# EAGLE design 64K SRAM Memory Controller (EAGLE 7.5.0)
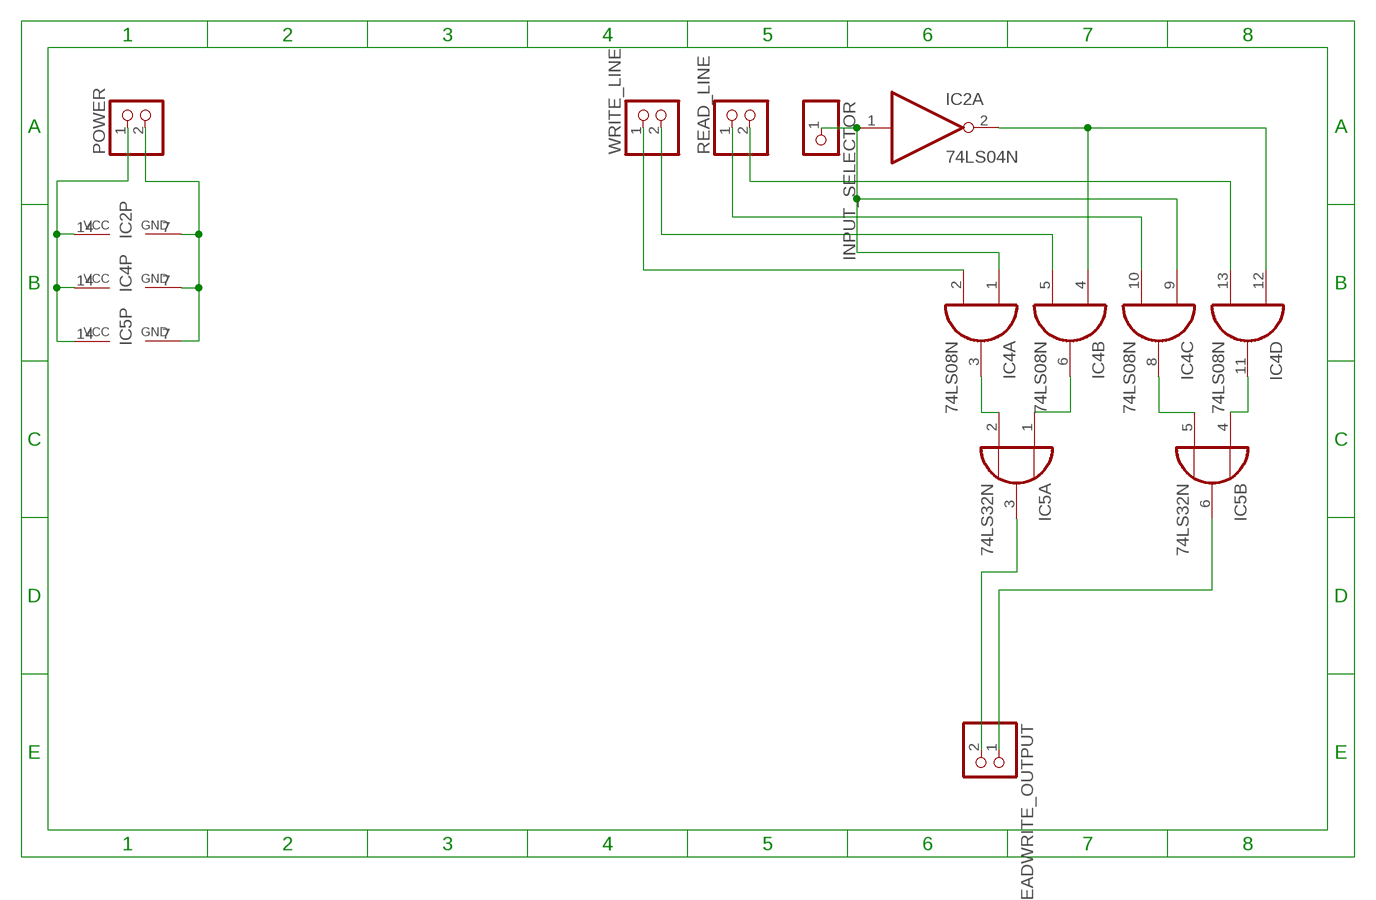
[diagram p0: schematic, sheet 1]

## Parts
IC2  74LS04N  [DIL14]
IC4  74LS08N  [DIL14]
IC5  74LS32N  [DIL14]
INPUT_SELECTOR  PINHD-1X1  [1X01]
POWER  PINHD-1X2  [1X02]
READ_LINE  PINHD-1X2  [1X02]
READWRITE_OUTPUT  PINHD-1X2  [1X02]
WRITE_LINE  PINHD-1X2  [1X02]

## Nets
GND: IC2.7(P:GND) IC4.7(P:GND) IC5.7(P:GND) POWER.2
N$18: IC2.1(A:I) IC4.1(A:I0) IC4.9(C:I0) INPUT_SELECTOR.1
N$19: IC5.6(B:O) READWRITE_OUTPUT.1
N$20: IC4.2(A:I1) WRITE_LINE.1
N$23: IC4.5(B:I1) WRITE_LINE.2
N$24: IC2.2(A:O) IC4.4(B:I0) IC4.12(D:I0)
N$25: IC5.3(A:O) READWRITE_OUTPUT.2
N$28: IC4.10(C:I1) READ_LINE.1
N$29: IC4.13(D:I1) READ_LINE.2
N$30: IC4.3(A:O) IC5.2(A:I1)
N$31: IC4.6(B:O) IC5.1(A:I0)
N$32: IC4.8(C:O) IC5.5(B:I1)
N$33: IC4.11(D:O) IC5.4(B:I0)
VCC: IC2.14(P:VCC) IC4.14(P:VCC) IC5.14(P:VCC) POWER.1
Unconnected: IC2.3(B:I) IC2.4(B:O) IC2.5(C:I) IC2.6(C:O) IC2.8(D:O) IC2.9(D:I) IC2.10(E:O) IC2.11(E:I) IC2.12(F:O) IC2.13(F:I) IC5.8(C:O) IC5.9(C:I0) IC5.10(C:I1) IC5.11(D:O) IC5.12(D:I0) IC5.13(D:I1)

## Library data of the parts
IC2 = 74xx-eu:74*04: Hex INVERTER
IC4 = 74xx-eu:74*08: Quad 2-input AND gate
IC5 = 74xx-eu:74*32: Quad 2-input OR gate
INPUT_SELECTOR = pinhead:PINHD-1X1: PIN HEADER
POWER READ_LINE READWRITE_OUTPUT WRITE_LINE = pinhead:PINHD-1X2: PIN HEADER

## Board
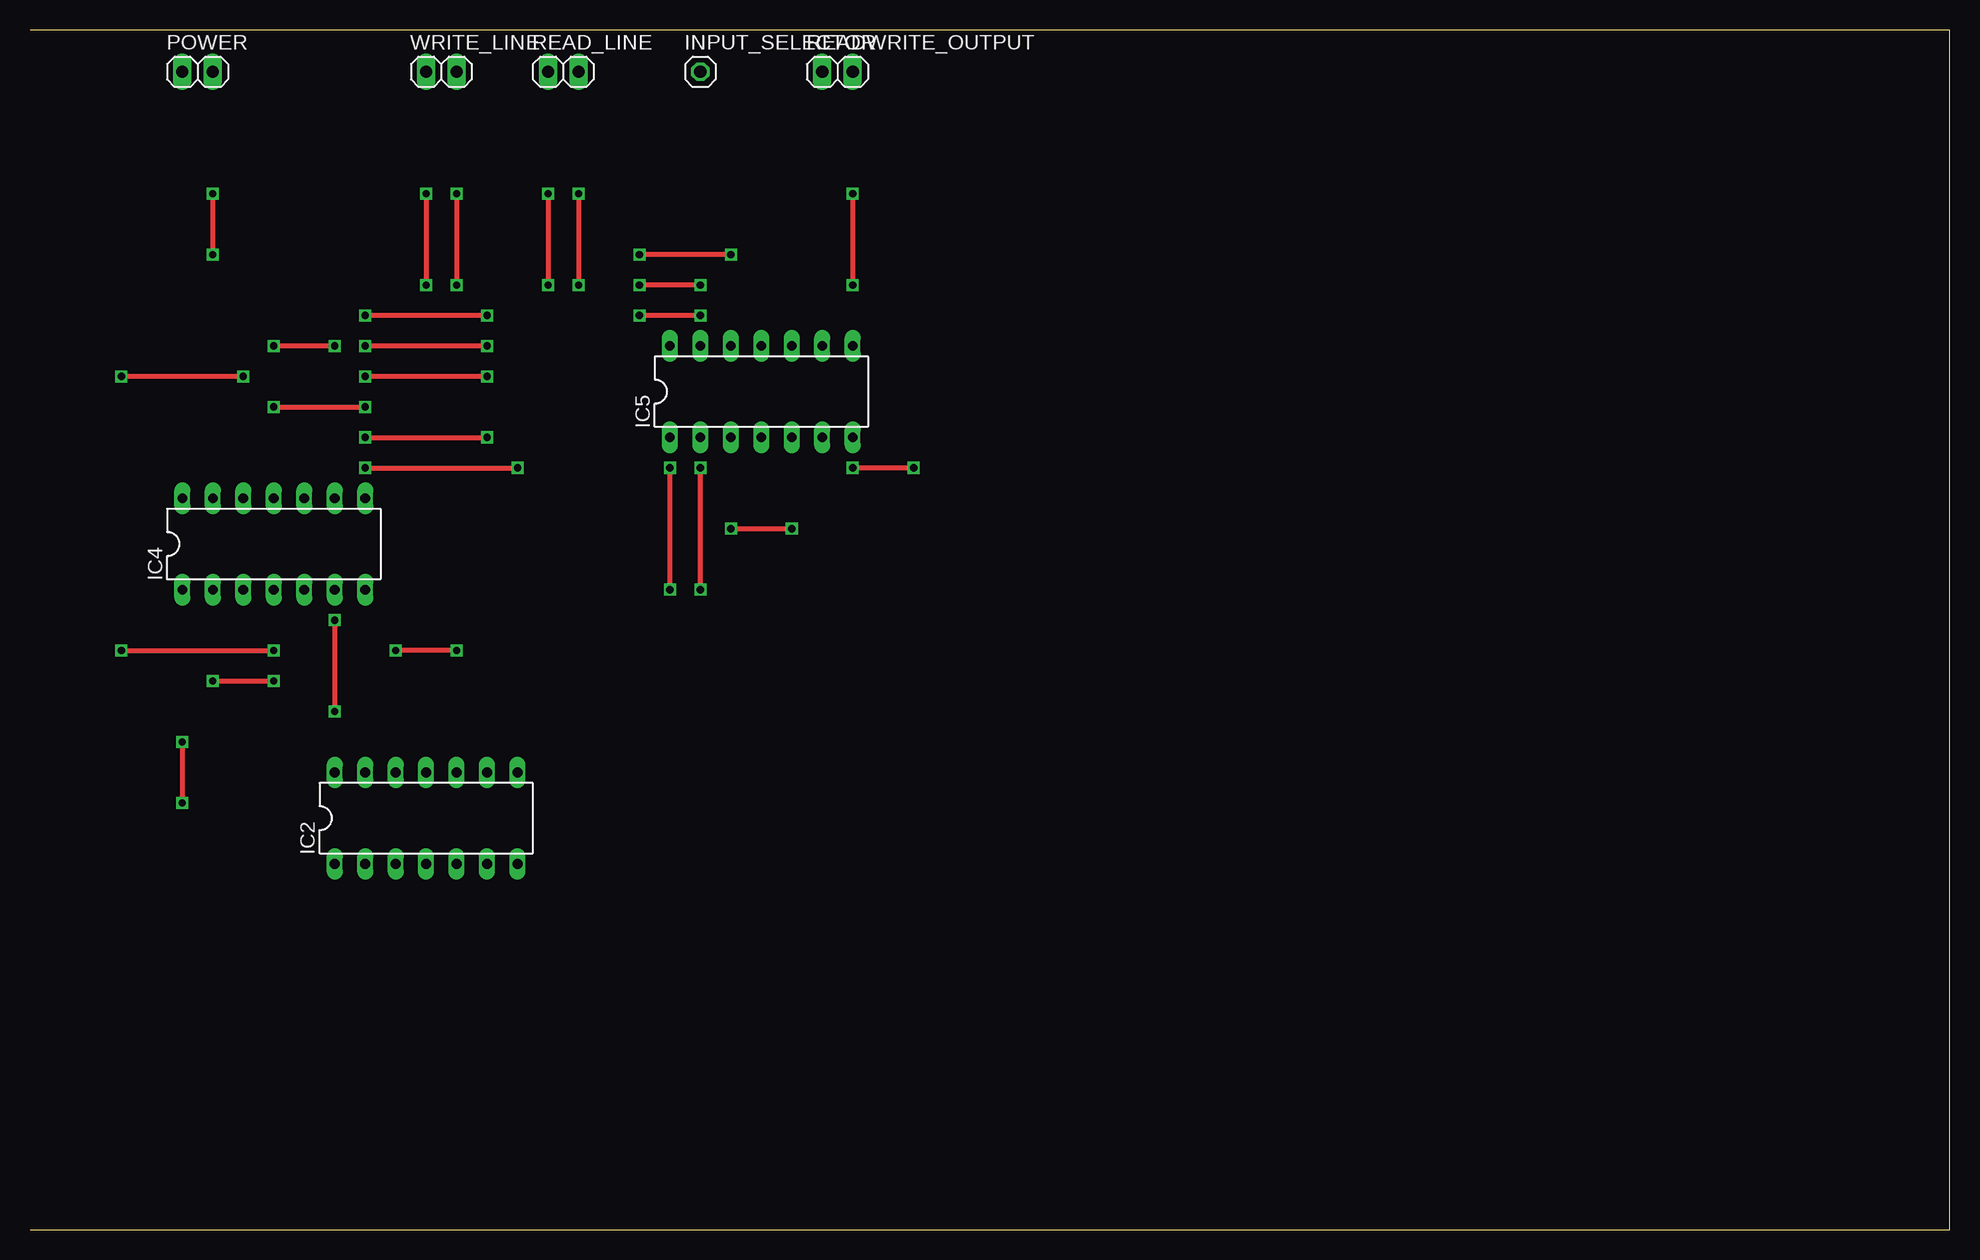
[diagram p1: board, top side]
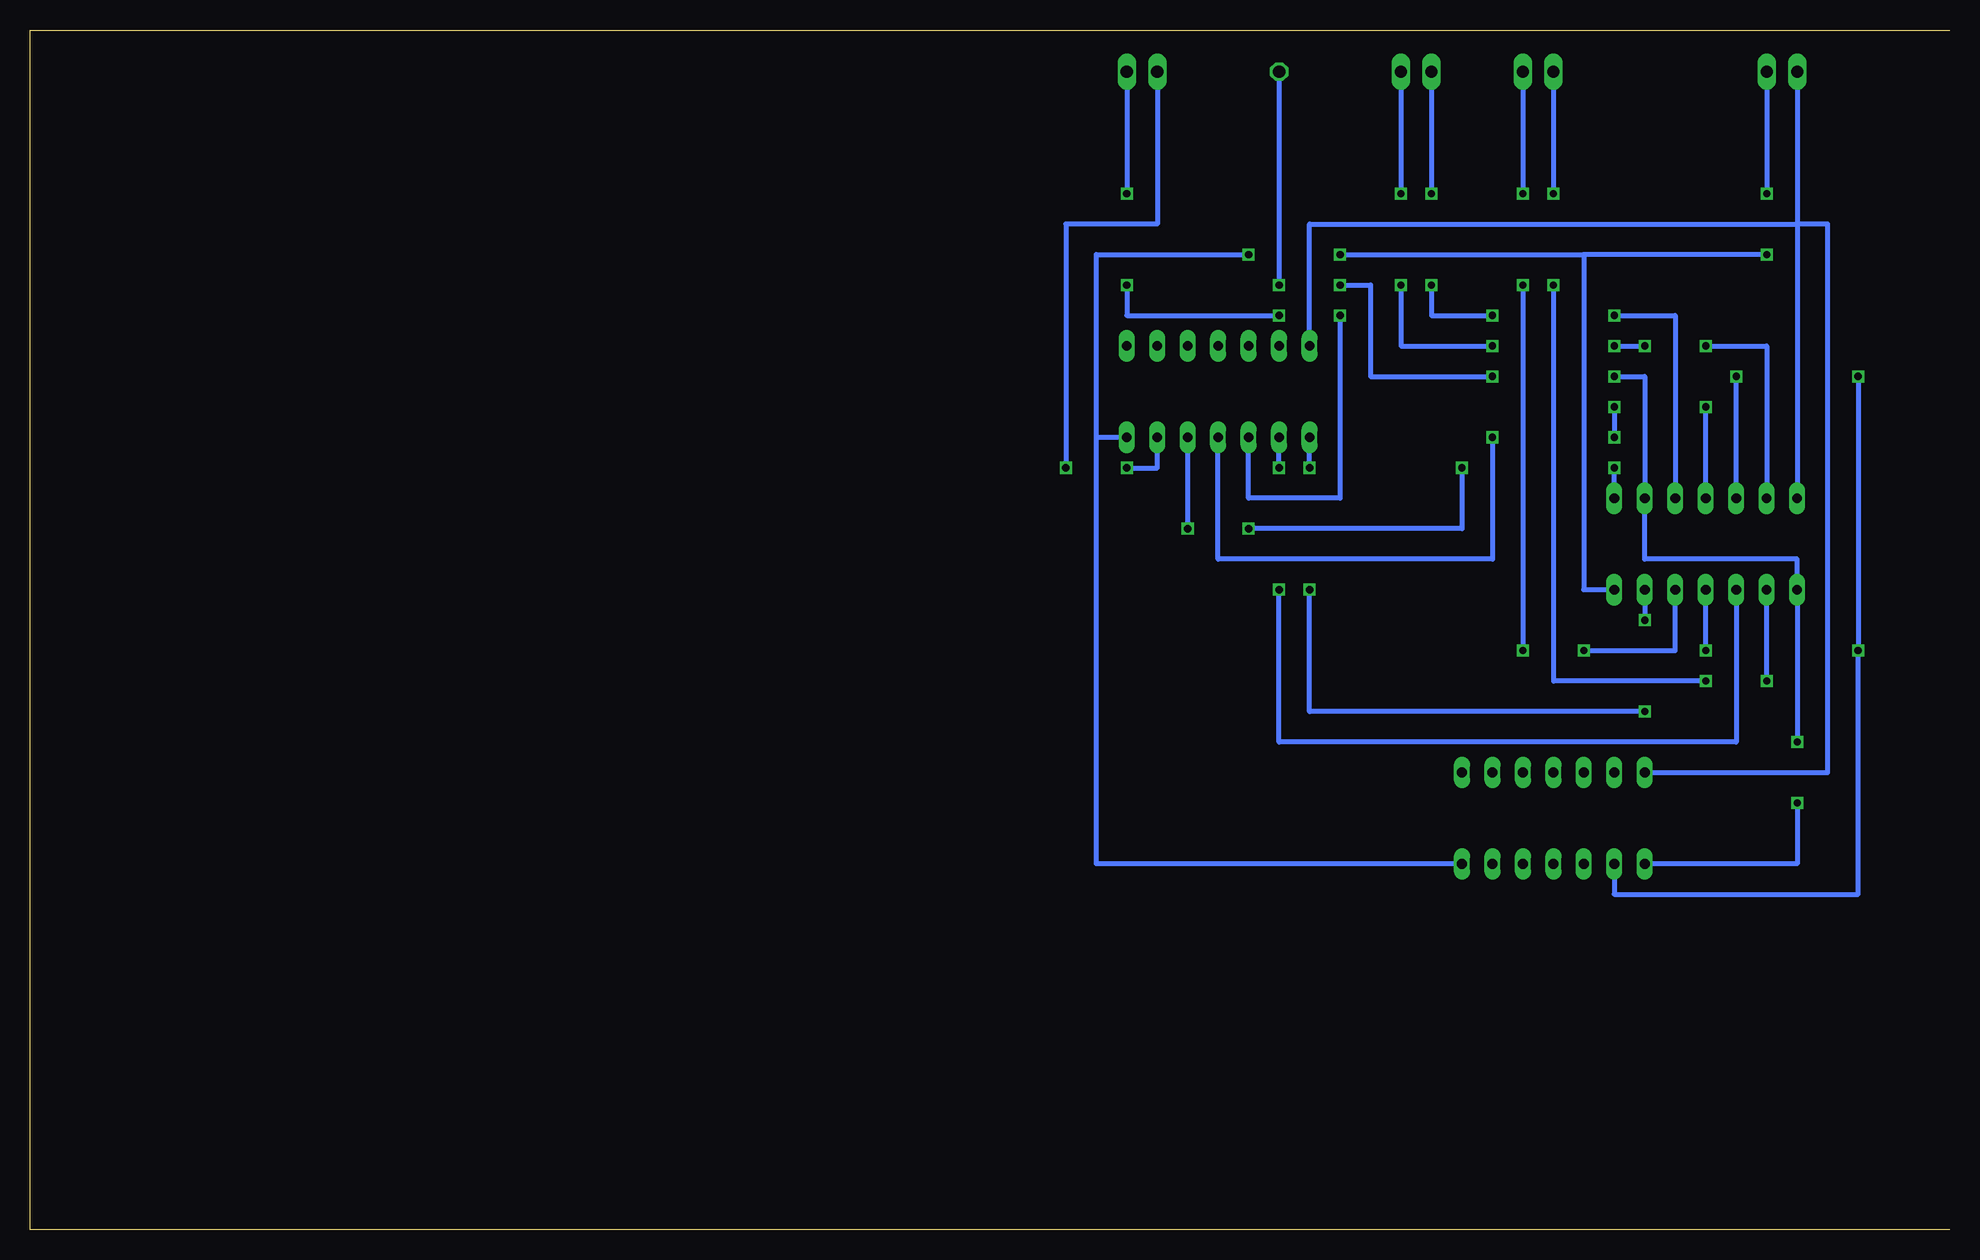
[diagram p2: board, bottom side, seen from below]

Size 160 x 100 mm. Coordinates in mm from the lower left corner, seen from the top.
Outline: 0,0 160,0 160,100 0,100
Copper layers (1*16): Top 0.035mm / dielectric 1.5mm / Bottom 0.035mm
Design rules "default": minimum track width 10mil, minimum drill 24mil, track to track 8mil, track to pad 8mil, pad to pad 8mil, via to via 8mil, smd to smd 8mil, copper to edge 40mil, drill to drill 8mil, minimum pad ring 10mil, minimum via ring 8mil, stop-mask expansion 4mil, vias tented up to drill 0mil, thermal gap 10mil

### Footprints (pad centres in the part's own frame; a part is rotated, then mirrored left to right if it is on the bottom)
DIL14 = drill 0.813 long: 1 -7.62,-3.81; 2 -5.08,-3.81; 3 -2.54,-3.81; 4 0,-3.81; 5 2.54,-3.81; 6 5.08,-3.81; 7 7.62,-3.81; 8 7.62,3.81; 9 5.08,3.81; 10 2.54,3.81; 11 0,3.81; 12 -2.54,3.81; 13 -5.08,3.81; 14 -7.62,3.81
1X01 = drill 1.016 octagon: 1 0,0
1X02 = drill 1.016 long: 1 -1.27,0; 2 1.27,0

### Placement (x,y rotation side)
IC2  33.02,34.29 0 top
IC4  20.32,57.15 0 top
IC5  60.96,69.85 0 top
INPUT_SELECTOR  55.88,96.52 0 top
POWER  13.97,96.52 0 top
READ_LINE  44.45,96.52 0 top
READWRITE_OUTPUT  67.31,96.52 0 top
WRITE_LINE  34.29,96.52 0 top

### Tracks (layer width: path | path; a pad name or v marks a point on that pad's centre or on a via)
GND  (via drill 0.6)
  Top 0.406: v15.24,86.36 v15.24,81.28 | v58.42,81.28 v50.8,81.28
  Bottom 0.406: POWER.2 v15.24,86.36 | v15.24,81.28 30.48,81.28 | 30.48,81.28 30.48,53.34 IC4.7 | IC5.7 71.12,66.04 | 71.12,66.04 71.12,81.28 v58.42,81.28 | v50.8,81.28 30.48,81.28 | IC2.7 71.12,30.48 71.12,66.04
N$18  (via drill 0.6)
  Top 0.406: v55.88,78.74 v50.8,78.74 | v38.1,71.12 v27.94,71.12 | v12.7,40.64 v12.7,35.56
  Bottom 0.406: INPUT_SELECTOR.1 v55.88,78.74 | v50.8,78.74 48.26,78.74 48.26,71.12 v38.1,71.12 | v27.94,71.12 25.4,71.12 IC4.9 25.4,55.88 12.7,55.88 IC4.1 v12.7,40.64 | v12.7,35.56 12.7,30.48 IC2.1
  other vias: 55.88,96.52
N$19  (via drill 0.6)
  Top 0.406: v73.66,63.5 v68.58,63.5
  Bottom 0.406: READWRITE_OUTPUT.1 66.04,83.82 73.66,83.82 v73.66,63.5 | v68.58,63.5 66.04,63.5 IC5.6
  other vias: 66.04,96.52 66.04,96.52
N$20  (via drill 0.6)
  Top 0.406: v33.02,86.36 v33.02,78.74 | v15.24,45.72 v20.32,45.72
  Bottom 0.406: WRITE_LINE.1 v33.02,86.36 | v33.02,78.74 33.02,45.72 v20.32,45.72 | v15.24,45.72 IC4.2
  other vias: 33.02,96.52
N$23  (via drill 0.6)
  Top 0.406: v35.56,86.36 v35.56,78.74 | v35.56,48.26 v30.48,48.26
  Bottom 0.406: WRITE_LINE.2 v35.56,86.36 | v35.56,78.74 v35.56,48.26 | v30.48,48.26 22.86,48.26 IC4.5
N$24  (via drill 0.6)
  Top 0.406: v17.78,71.12 v7.62,71.12 | v7.62,48.26 v20.32,48.26
  Bottom 0.406: IC4.12 v17.78,71.12 | v7.62,71.12 v7.62,48.26 7.62,27.94 27.94,27.94 IC2.2 | v20.32,48.26 IC4.4
N$25  (via drill 0.6)
  Top 0.406: v68.58,86.36 v68.58,78.74 | v55.88,76.2 v50.8,76.2
  Bottom 0.406: READWRITE_OUTPUT.2 v68.58,86.36 | v68.58,78.74 68.58,76.2 v55.88,76.2 | v50.8,76.2 50.8,60.96 58.42,60.96 IC5.3
N$28  (via drill 0.6)
  Top 0.406: v43.18,86.36 v43.18,78.74 | v38.1,76.2 v27.94,76.2
  Bottom 0.406: READ_LINE.1 v43.18,86.36 | v43.18,78.74 43.18,76.2 v38.1,76.2 | v27.94,76.2 22.86,76.2 IC4.10
N$29  (via drill 0.6)
  Top 0.406: v45.72,86.36 v45.72,78.74 | v38.1,73.66 v27.94,73.66 | v25.4,73.66 v20.32,73.66
  Bottom 0.406: READ_LINE.2 v45.72,86.36 | v45.72,78.74 45.72,73.66 v38.1,73.66 | v27.94,73.66 v25.4,73.66 | v20.32,73.66 15.24,73.66 IC4.13
N$30  (via drill 0.6)
  Top 0.406: v55.88,53.34 v55.88,63.5
  Bottom 0.406: IC4.3 17.78,40.64 55.88,40.64 v55.88,53.34 | v55.88,63.5 IC5.2
N$31  (via drill 0.6)
  Top 0.406: v25.4,50.8 v25.4,43.18 | v53.34,53.34 v53.34,63.5
  Bottom 0.406: IC4.6 v25.4,50.8 | v25.4,43.18 53.34,43.18 v53.34,53.34 | v53.34,63.5 IC5.1
N$32  (via drill 0.6)
  Top 0.406: v27.94,63.5 v40.64,63.5 | v58.42,58.42 v63.5,58.42
  Bottom 0.406: IC4.8 v27.94,63.5 | v40.64,63.5 40.64,58.42 v58.42,58.42 | v63.5,58.42 IC5.5
N$33  (via drill 0.6)
  Top 0.406: v20.32,68.58 v27.94,68.58 | v27.94,66.04 v38.1,66.04
  Bottom 0.406: IC4.11 v20.32,68.58 | v27.94,68.58 v27.94,66.04 | v38.1,66.04 38.1,55.88 60.96,55.88 IC5.4
VCC
  Bottom 0.406: POWER.1 12.7,83.82 | 12.7,83.82 IC4.14 | IC5.14 53.34,83.82 12.7,83.82 | IC2.14 10.16,38.1 10.16,83.82 12.7,83.82